# Altium schematic sheet PSoC.SchDoc
size A
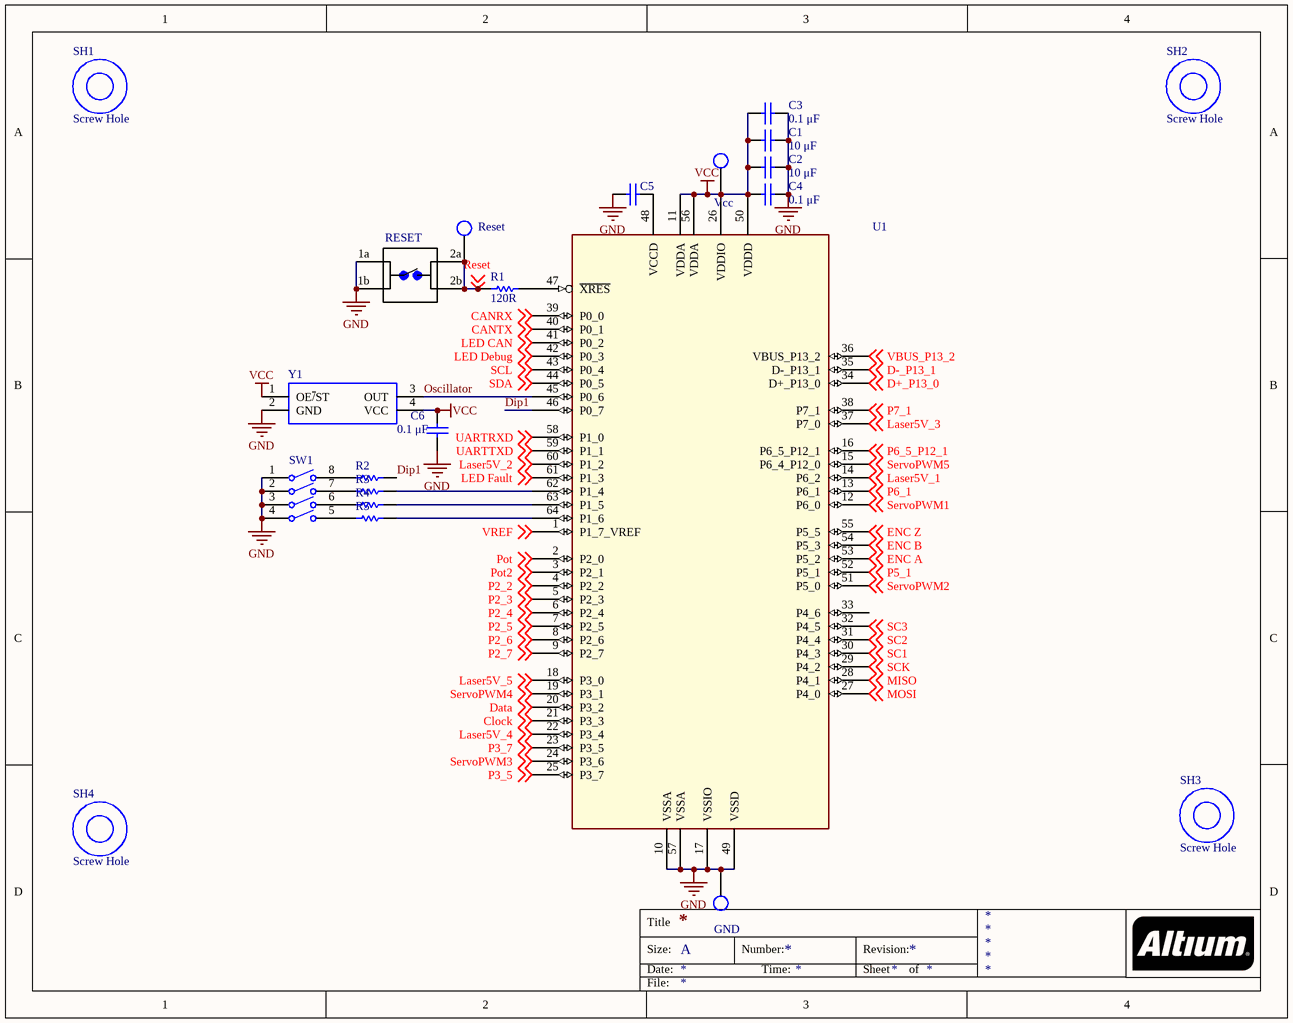
[diagram p0: PSoC.SchDoc]

## Parts
(Parts that share a designator on the sheet are numbered #1, #2 ... from top to bottom, then left to right.)
C1  10 μF  [Cap 0805]
C2  10 μF  [Cap 0805]
C3  0.1 μF  [Cap 0805]
C4  0.1 μF  [Cap 0805]
C5  1 μF  [Cap 0805]  (value not drawn)
C6  0.1 μF  [Cap 0805]
GND  Test Point  [Test Point pad]  (value not drawn)
R1  120R  [RESC0805(2012)_N]
R2  120R  [RESC0805(2012)_N]  (value not drawn)
R3  120R  [RESC0805(2012)_N]  (value not drawn)
R4  120R  [RESC0805(2012)_N]  (value not drawn)
R5  120R  [RESC0805(2012)_N]  (value not drawn)
RESET#1  1825910-7  [Switch 6mm 24V (NO)]  (value not drawn)
Reset#2  Test Point  [Test Point pad]  (value not drawn)
SH1  Screw Hole  [Screw Hole]
SH2  Screw Hole  [Screw Hole]
SH3  Screw Hole  [Screw Hole]
SH4  Screw Hole  [Screw Hole]
SW1  TDA04H0SB1  [CKCP-TDA04H0SB1R_V]  (value not drawn)
U1  CY8C4248AZI-L485  [TQFP50P1200X1200X160-64N]  (value not drawn)
Vcc  Test Point  [Test Point pad]  (value not drawn)
Y1  SG-636PCW_50.0000MC3__ROHS  [SG-636_3D]  (value not drawn)

## Nets
GND: C1.1 C2.2 C3.1 C4.2 C5.1 C6.1 GND.1 RESET#1.1a RESET#1.1b SW1.1 SW1.2 SW1.3 SW1.4 U1.10(VSSA) U1.17(VSSIO) U1.49(VSSD) U1.57(VSSA) Y1.2(GND)
VCC: C1.2 C2.1 C3.2 C4.1 C6.2 U1.11(VDDA) U1.26(VDDIO) U1.50(VDDD) U1.56(VDDA) Vcc.1 Y1.1(OE~{/}ST) Y1.4(VCC)
CANRX: U1.39(P0_0) ; off-sheet CANRX
CANTX: U1.40(P0_1) ; off-sheet CANTX
Clock: U1.21(P3_3) ; off-sheet Clock
D+_P13_0: U1.34(D+_P13_0) ; off-sheet D+_P13_0
D-_P13_1: U1.35(D-_P13_1) ; off-sheet D-_P13_1
Data: U1.20(P3_2) ; off-sheet Data
Dip1: R2.2 U1.46(P0_7)
ENC A: U1.53(P5_2) ; off-sheet ENC A
ENC B: U1.54(P5_3) ; off-sheet ENC B
ENC Z: U1.55(P5_5) ; off-sheet ENC Z
Laser5V_1: U1.14(P6_2) ; off-sheet Laser5V_1
Laser5V_2: U1.60(P1_2) ; off-sheet Laser5V_2
Laser5V_3: U1.37(P7_0) ; off-sheet Laser5V_3
Laser5V_4: U1.22(P3_4) ; off-sheet Laser5V_4
Laser5V_5: U1.18(P3_0) ; off-sheet Laser5V_5
LED CAN: U1.41(P0_2) ; off-sheet LED CAN
LED Debug: U1.42(P0_3) ; off-sheet LED Debug
LED Fault: U1.61(P1_3) ; off-sheet LED Fault
MISO: U1.28(P4_1) ; off-sheet MISO
MOSI: U1.27(P4_0) ; off-sheet MOSI
Oscillator: U1.45(P0_6) Y1.3(OUT)
P2_2: U1.4(P2_2) ; off-sheet P2_2
P2_3: U1.5(P2_3) ; off-sheet P2_3
P2_4: U1.6(P2_4) ; off-sheet P2_4
P2_5: U1.7(P2_5) ; off-sheet P2_5
P2_6: U1.8(P2_6) ; off-sheet P2_6
P2_7: U1.9(P2_7) ; off-sheet P2_7
P3_5: U1.25(P3_7) ; off-sheet P3_5
P3_7: U1.23(P3_5) ; off-sheet P3_7
P5_1: U1.52(P5_1) ; off-sheet P5_1
P6_1: U1.13(P6_1) ; off-sheet P6_1
P6_5_P12_1: U1.16(P6_5_P12_1) ; off-sheet P6_5_P12_1
P7_1: U1.38(P7_1) ; off-sheet P7_1
Pot: U1.2(P2_0) ; off-sheet Pot
Pot2: U1.3(P2_1) ; off-sheet Pot2
Reset: R1.1 RESET#1.2a RESET#1.2b Reset#2.1 ; off-sheet Reset
SC1: U1.30(P4_3) ; off-sheet SC1
SC2: U1.31(P4_4) ; off-sheet SC2
SC3: U1.32(P4_5) ; off-sheet SC3
SCK: U1.29(P4_2) ; off-sheet SCK
SCL: U1.43(P0_4) ; off-sheet SCL
SDA: U1.44(P0_5) ; off-sheet SDA
ServoPWM1: U1.12(P6_0) ; off-sheet ServoPWM1
ServoPWM2: U1.51(P5_0) ; off-sheet ServoPWM2
ServoPWM3: U1.24(P3_6) ; off-sheet ServoPWM3
ServoPWM4: U1.19(P3_1) ; off-sheet ServoPWM4
ServoPWM5: U1.15(P6_4_P12_0) ; off-sheet ServoPWM5
UARTRXD: U1.58(P1_0) ; off-sheet UARTRXD
UARTTXD: U1.59(P1_1) ; off-sheet UARTTXD
VBUS_P13_2: U1.36(VBUS_P13_2) ; off-sheet VBUS_P13_2
VREF: U1.1(P1_7_VREF) ; off-sheet VREF
NetC5_2: C5.2 U1.48(VCCD)
NetR1_2: R1.2 U1.47(~{XRES})
NetR2_1: R2.1 SW1.8
NetR3_1: R3.1 SW1.7
NetR3_2: R3.2 U1.62(P1_4)
NetR4_1: R4.1 SW1.6
NetR4_2: R4.2 U1.63(P1_5)
NetR5_1: R5.1 SW1.5
NetR5_2: R5.2 U1.64(P1_6)

Not connected (* = marked no-connect by the designer): U1 33(P4_6)

## Notes on the sheet
- Title
- Size:
- Date:
- A
- Number:
- Time:
- Revision:
- Sheet
- of
- File:

## Library data of the parts
C1-C6 = Capacitor 0805: Standard Capacitor; Mounting Technology: SurfaceMount; Case Size/Dimension: 0805; Package Reference: 0805
  C1 C2: Capacitance: 10 μF
  C3 C4 C6: Capacitance: 0.1 μF
  C5: Capacitance: 1 μF
R1 = Resistor 0805: Generic 0805 Resistor; Tolerance: 5 %; Case-Metric: 2012; Case-EIA: 0805; Power: 0.125 W; Technology: SMT; Value: 120R
R2-R5 = Resistor 0805: Generic 0805 Resistor; Case-EIA: 0805; Tolerance: 5 %; Case-Metric: 2012; Power: 0.125 W; Technology: SMT; Value: 120R
RESET#1 = Switch 6mm 24V (NO): FSM4JAH=6MM TACT SWITCH, HIGH TEMP; MF: TE Connectivity; Contact_Current_Rating: 50 mA; Configuration_Pole-Throw: Single Pole - Single Throw; Package: None; Digi-Key_Part_Number: 450-1804-ND; Digi-Key_Purchase_URL: https://www.digikey.com/product-detail/en/te-connectivity-alcoswitch-switches/1825910-7/450-1804-ND/1731414?utm_source=snapeda&utm_medium=aggregator&utm_campaign=symbol; MP: 1825910-7; SnapEDA_Link: https://www.snapeda.com/parts/1825910-7/TE%20Connectivity%20ALCOSWITCH%20Switches/view-part/?ref=snap; EU_RoHS_Compliance: Compliant; TE_purchase_URL: https://www.te.com/usa-en/product-1825910-7.html?te_bu=Cor&te_type=disp&te_campaign=seda_glo_cor-seda-global-disp-prtnr-fy19-seda-model-bom-cta_sma-317_1&elqCampaignId=32493; Value: *
SH1-SH4 = Screw Hole: Add 4 of these to your design for screw hole mounting
SW1 = Dip Switch Array SMD Half-Pitch: Ultra-Miniature Surface Mount Half-Pitch DIP Switch, 25 mA, 24 V, -40 to 85 degC, 8-Pin SMD, RoHS, Tube; Contact Current Rating: 100 mA; Throw Configuration: SPST; Voltage Rating (DC): 24 V; Max Contact Resistance: 100 mohm; Max Current Rating: 25 mA; REACH SVHC: No SVHC; DatasheetVersion: 02/2016; Case\Package: DIP; Package Quantity: 70; Lead Pitch: 1.27 mm; Contact Plating: Gold; Packaging: Rail/Tube; Contact Finish: Gold; Mount: Surface Mount; Height: 2.3 mm; Contact Material: Copper; Max Operating Temperature: 85 degC; Max Voltage Rating (DC): 24 V; ComponentLink1URL: http://www.ck-components.com/media/1328/tda.pdf; PackageDescription: 8-Pin Surface Mount Device, Body 6.21 x 6.2 mm, Pitch 1.27 mm; Radiation Hardening: No; ComponentLink1Description: Datasheet; Current Rating: 100 mA; RoHSCompliant: true; PackageReference: TDA04H0SB1R; Min Operating Temperature: -40 degC; Pins: 4; Mounting Technology: Surface Mount; Length: 6.21 mm
U1 = PSOC MC: 64 pin psoc; Part_Number: CY8C4248AZI-L485
Y1 = Oscilator: Standard Clock Oscillators; Manufacturer_Name: Epson Timing; Manufacturer_Part_Number: SG-636PCW 50.0000MC3: ROHS; RS Part Number: *; RS Price/Stock: *; Arrow Part Number: SG-636PCW 50.0000MC3: ROHS; Arrow Price/Stock: *; Datasheet Link: http://www.mouser.com/ds/2/137/G-636PCE_en-1003252.pdf